# Altium schematic sheet MACH_NGUON.SchDoc
size A
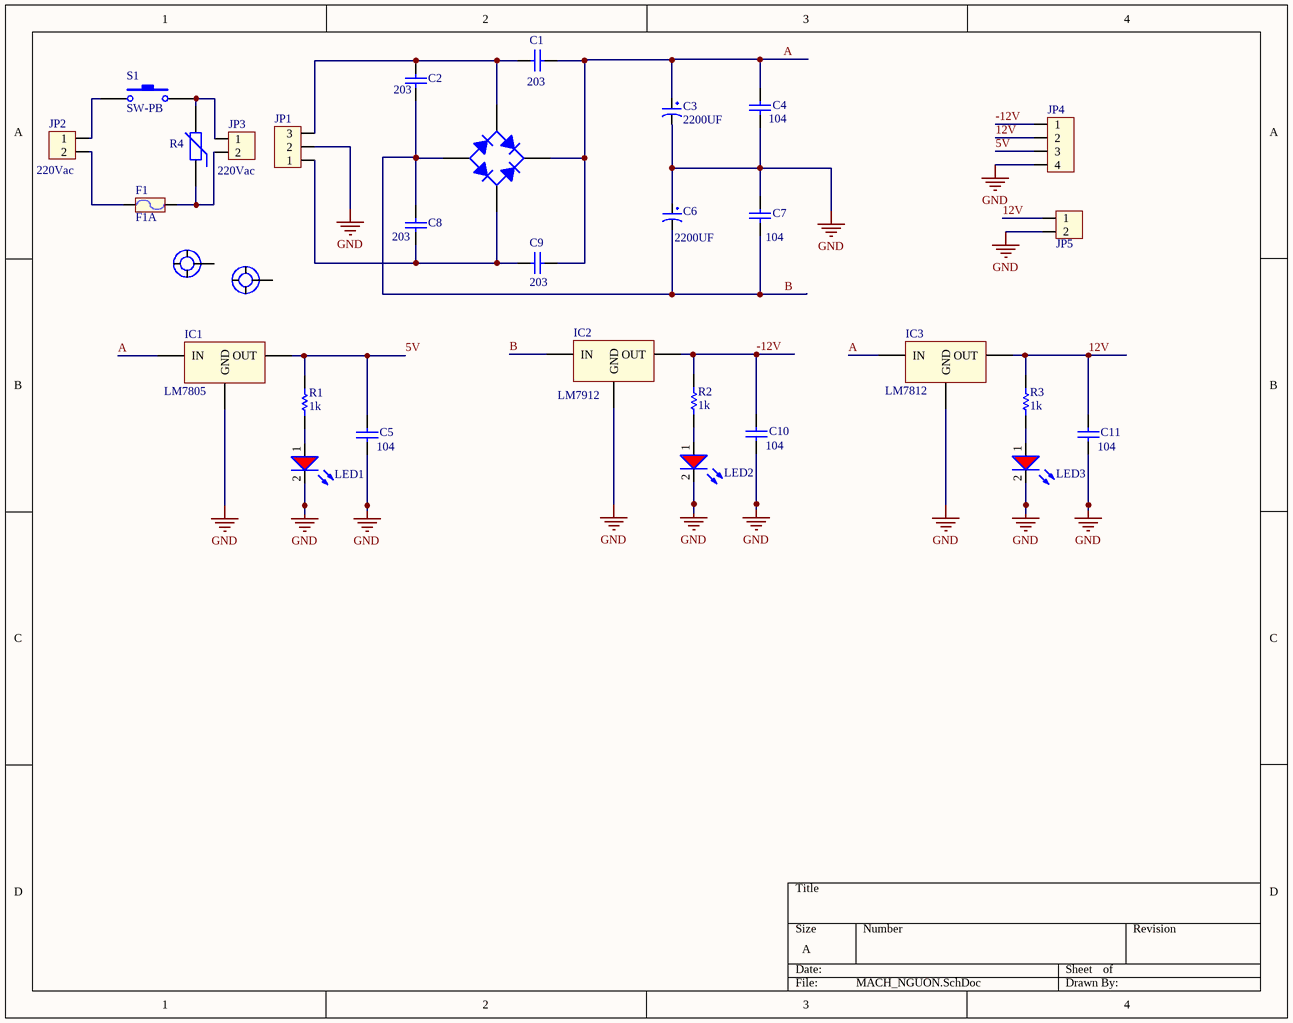
[diagram p0: MACH_NGUON.SchDoc]

## Parts
C1  value 203  [CAPNTO2.54-3.05x1.78A]  (hidden comment: 5AK102KABAA)
C2  value 203  [CAPNTO2.54-3.05x1.78A]  (hidden comment: 5AK102KABAA)
C3  2200UF  [CAP_2200UF_25V]
C4  value 104  [Tu gom 104]  (hidden comment: 5AK102KABAA)
C5  value 104  [Tu gom 104]  (hidden comment: 5AK102KABAA)
C6  2200UF  [CAP_2200UF_25V]
C7  value 104  [Tu gom 104]  (hidden comment: 5AK102KABAA)
C8  value 203  [CAPNTO2.54-3.05x1.78A]  (hidden comment: 5AK102KABAA)
C9  value 203  [CAPNTO2.54-3.05x1.78A]  (hidden comment: 5AK102KABAA)
C10  value 104  [Tu gom 104]  (hidden comment: 5AK102KABAA)
C11  value 104  [Tu gom 104]  (hidden comment: 5AK102KABAA)
D1  Bridge1  [BRIDGE DIODE 2A]  (value not drawn)
F1  F1A  [FUSE2_5A]
IC1  LM7805  [LM7805]
IC2  LM7912  [LM7805]
IC3  LM7812  [LM7805]
JP1  ED2610-ND  [DOMINO_OSTTC_3P]  (value not drawn)
JP2  220Vac  [DOMINO-MKDS-2-PIN]
JP3  220Vac  [DOMINO-MKDS-2-PIN]
JP4  JP4  [CON4]  (value not drawn)
JP5  JP2  [CON2]  (value not drawn)
LED1  RED LED 5mm  [LED5R]  (value not drawn)
LED2  RED LED 5mm  [LED5R]  (value not drawn)
LED3  RED LED 5mm  [LED5R]  (value not drawn)
R1  1k  [RES 1/4W CFR25]
R2  1k  [RES 1/4W CFR25]
R3  1k  [RES 1/4W CFR25]
R4  Res Varistor  [VARISTOR]  (value not drawn)
S1  SW-PB  [BUTTON 2PIN TRON]
S2  Screw  [Screw 3.0 v2]  (value not drawn)
S3  Screw  [Screw 3.0 v2]  (value not drawn)

## Nets
GND: C3.2 C4.1 C5.1 C6.1 C7.2 C10.1 C11.1 IC1.2(GND) IC2.1(GND) IC3.2(GND) JP1.2 JP4.4 JP5.2 LED1.2(K) LED2.2(K) LED3.2(K)
5V: C5.2 IC1.3(OUT) JP4.3 R1.2
12V: C11.2 IC3.3(OUT) JP4.2 JP5.1 R3.2
-12V: C10.2 IC2.3(OUT) JP4.1 R2.2
A: C1.2 C3.1 C4.2 C9.2 D1.1(K) IC1.1(IN) IC3.1(IN)
B: C2.1 C6.2 C7.1 C8.2 D1.3(A) IC2.2(IN)
NetC1_1: C1.1 C2.2 D1.4(C) JP1.3
NetC8_1: C8.1 C9.1 D1.2(C) JP1.1
NetF1_1: F1.1 JP2.2
NetF1_2: F1.2 JP3.2 R4.1
NetJP2_1: JP2.1 S1.1
NetJP3_1: JP3.1 R4.2 S1.2
NetLED1_1: LED1.1(A) R1.1
NetLED2_1: LED2.1(A) R2.1
NetLED3_1: LED3.1(A) R3.1

Not connected (* = marked no-connect by the designer): S2 1; S3 1

## Library data of the parts
C1 C2 C4 C5 C7-C11 = 5AK102KABAA: CAP NPO CAPNTO 1nF 100V 10%; ComponentLink1Description: Datasheet; ComponentLink1URL: D:\Dropbox\Datasheets\Passive Components\Capacitors\AVX Disc Ceramic Capacitors.pdf; Unit Price: 0.003
C3 C6 = CP1: Cap P  0,1uF < 22uF , 16 - 50V; Value: 10uF/50V; Description 1: 10 => 220uF/6,3V/10V - 10uF => 100uF/16V; Description 2: 0,1uF => 33uF/50V - 10uF => 22uF/63V; Description 3: 0,47uF => 10uF/100V
D1 = Bridge1: Full Wave Diode Bridge; Published: 8-Jun-2000; LatestRevisionDate: 29-May-2009; LatestRevisionNote: Sch pins A & K swapped.; DatasheetVersion: E2732B; PackageReference: D-38; Publisher: Altium Limited; PackageDescription: Bridge Rectifier; 4 Terminals; Body 9.4 x 9.4 mm (typ); Pitch 5.08 mm
F1 = Fuse: Designed by: VanDungEvn; Value: Fuse
IC1 = LM78xx: On ap +, from + 5 to + 24VDC; Value: LM7805
IC2 = LM79xx: On ap -, from - 5 to - 24VDC; Value: LM7905
IC3 = LM78xx: On ap +, from + 5 to + 24VDC; Value: LM7805
JP1 = Con3_1: Connector 3; Value: Connector 3
JP2 JP3 JP5 = Con2: Connector 2; Value: Connector 2
JP4 = Con4: Connector 4; Value: Connector 4
LED1-LED3 = LED_RED_5MM: LED Red 5mm; Manufacturer: Broadcom Limited; Cost (VNĐ): 1000; Lens Transparency: Clear; Millicandela Rating: 60mcd; Lens Style/Size: Round with Domed Top, 5mm (T-1 3/4), 4.83mm; Voltage - Forward (Vf) (Typ): 1.9V; Current - Test: 10mA; Viewing Angle: 35°; Wavelength - Dominant: 626nm; Wavelength - Peak: 635nm; BuyLink: http://www.tme.vn/Product.aspx?id=1277#page=pro_info; Value: RED LED 5mm; Supplier 1: Digi-Key; Supplier Part Number 1: 516-1335-ND; Manufacturer Part Number: HLMP-3316; RoHS: RoHS Compliant; Category: Optoelectronics; Stock 1: 11943; Pricing 1: 1=0.41, 10=0.294, 25=0.24, 100=0.192, 250=0.162, 500=0.138, 1000=0.108, 2500=0.099 (USD); Packaging: Bulk; Part Status: Active; Color: Red; Lens Color: Red; Mounting Type: Through Hole; Features: -; Package / Case: Radial; Supplier Device Package: T-1 3/4; Size / Dimension: -; Height (Max): 9.19mm; ComponentLink1URL: https://docs.broadcom.com/docs/AV02-1023EN; ComponentLink1Description: https://docs.broadcom.com/docs/AV02-1023EN
R1-R3 = Trở 330R 1/4W: CF14JT330RTR-ND 330R 1/4W; Manufacturer: Stackpole Electronics Inc.; Cost (VNĐ): 50; Resistance (Ohms): 330; Tolerance: ±5%; Power (Watts): 0.25W, 1/4W; Temperature Coefficient: 0/ -400ppm/°C; BuyLink: http://www.tme.vn/Product.aspx?id=1004#page=pro_info; Supplier 1: Digi-Key; Supplier Part Number 1: CF14JT330RTR-ND; Manufacturer Part Number: CF14JT330R; RoHS: RoHS Compliant; Category: Resistors; Stock 1: 240000; Pricing 1: 5000=0.00475, 10000=0.00413, 25000=0.00363, 50000=0.00333, 125000=0.00326 (USD); Packaging: Tape & Reel (TR); Part Status: Active; Composition: Carbon Film; Features: Flame Retardant Coating, Safety; Operating Temperature: -55°C ~ 155°C; Package / Case: Axial; Supplier Device Package: Axial; Size / Dimension: 0.091" Dia x 0.236" L (2.30mm x 6.00mm); Height - Seated (Max): -; Failure Rate: -; ComponentLink1URL: https://www.seielect.com/Catalog/SEI-CF_CFM.pdf; ComponentLink1Description: https://www.seielect.com/Catalog/SEI-CF_CFM.pdf; Value: 1k
R4 = Res Varistor: Varistor (Voltage-Sensitive Resistor); Published: 24-Mar-1999; LatestRevisionDate: 29-May-2009; LatestRevisionNote: IPC-7351 Footprint Added.; PackageVersion: Mar-2003; PackageReference: 6-0805; Publisher: Altium Limited; PackageDescription: Chip Resistor 0805 Case Size; Code_IPC: RESC2012
S1 = SW-PB: Switch; Published: 24-Mar-1999; LatestRevisionDate: 17-Jul-2002; LatestRevisionNote: Re-released for DXP Platform.; PackageReference: SPST-2; Publisher: Altium Limited; PackageDescription: Switch; 2 Leads